# EAGLE schematic photoboard2a (EAGLE 7.5.0)
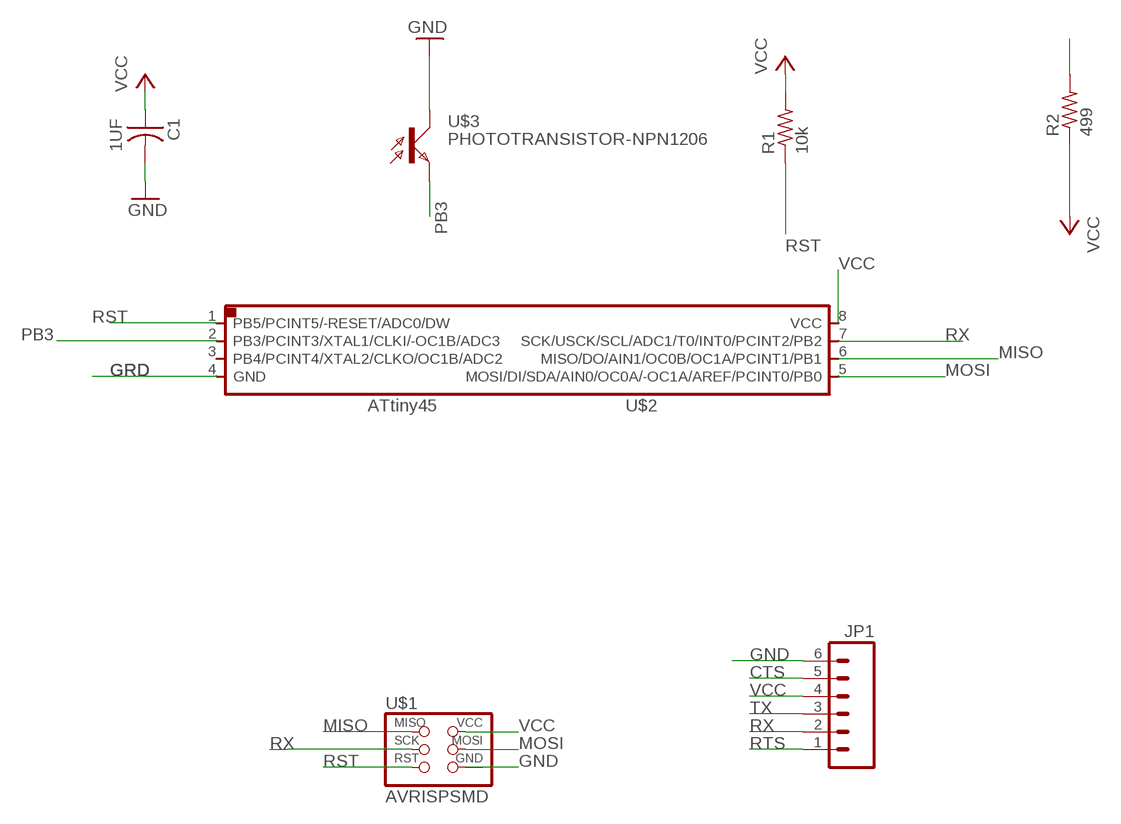
[diagram p0: schematic, sheet 1]

## Parts
C1  1UF  CAP-US1206FAB  [C1206FAB]
JP1  M06SMD  [1X06-SMD]
R1  10k  RES-US1206  [R1206]
R2  499  RES-US1206  [R1206]
U$1  AVRISPSMD  [2X03SMD]
U$2  ATTINY45SI  [SOIC8]
U$3  PHOTOTRANSISTOR-NPN1206  [OP1206]

## Nets
CTS: JP1.5
GND: C1.2 JP1.6 U$1.6(GND) U$3.COLLECTOR(C)
GRD: U$2.4(GND)
MISO: U$1.1(MISO) U$2.6(MISO/DO/AIN1/OC0B/OC1A/PCINT1/PB1)
MOSI: U$1.4(MOSI) U$2.5(MOSI/DI/SDA/AIN0/OC0A/-OC1A/AREF/PCINT0/PB0)
PB3: R2.2 U$2.2(PB3/PCINT3/XTAL1/CLKI/-OC1B/ADC3) U$3.EMITTER(E)
RST: R1.1 U$1.5(RST) U$2.1(PB5/PCINT5/-RESET/ADC0/DW)
RTS: JP1.1
RX: JP1.2 U$1.3(SCK) U$2.7(SCK/USCK/SCL/ADC1/T0/INT0/PCINT2/PB2)
TX: JP1.3
VCC: C1.1 JP1.4 R1.2 R2.1 U$1.2(VCC) U$2.8(VCC)
Unconnected: U$2.3(PB4/PCINT4/XTAL2/CLKO/OC1B/ADC2)

## Library data of the parts
C1 = fab:CAP-US
JP1 = SparkFun:M06: Header 6 Standard 6-pin 0.1" header. Use with straight break away headers (SKU : PRT-00116), right angle break away headers (PRT-00553), swiss pins (PRT-00743), machine pins (PRT-00117), and female headers (PRT-00115). Molex polarized connector foot print use with SKU : PRT-08094 with associated crimp pins and housings. NOTES ON THE VARIANTS LOCK and LOCK_LONGPADS... This footprint was designed to help hold the alignment of a through-hole component (i.e. 6-pin header) while soldering it into place. You may notice that each hole has been shifted either up or down by 0.005 of an inch from it's more standard position (which is a perfectly straight line). This slight alteration caused the pins (the squares in the middle) to touch the edges of the holes. Because they are alternating, it causes a "brace" to hold the component in place. 0.005 has proven to be the perfect amount of "off-center" position when using our standard breakaway headers. Although looks a little odd when you look at the bare footprint, once you have a header in there, the alteration is very hard to notice. Also, if you push a header all the way into place, it is covered up entirely on the bottom side. This idea of altering the position of holes to aid alignment will be further integrated into the Sparkfun Library for other footprints. It can help hold any component with 3 or more connection pins.
R1 R2 = fab:RES-US: Resistor (US Symbol) Variants with postfix FAB are widened to allow the routing of internal traces
U$1 = fab:AVRISP
U$2 = fab:ATTINY45
U$3 = fab:PHOTOTRANSISTOR-NPN

## Net classes
0 default: clearance 0.205 mm